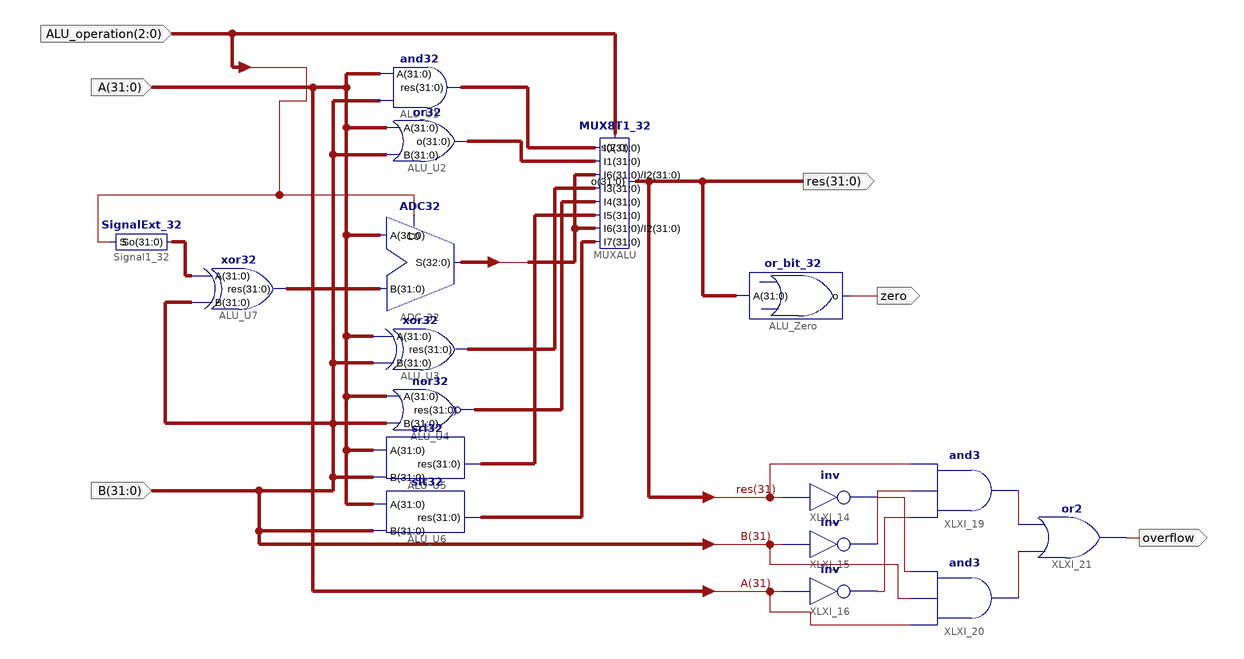
[diagram p0: schematic sheet 1]
// Xilinx ISE schematic ALU.sch (kintex7) as structural Verilog: 17 symbols, 6 ports
module ALU (
  input  [31:0] A,
  input  [31:0] B,
  input  [2:0] ALU_operation,
  output [31:0] res,
  output zero,
  output overflow
);

  wire XLXN_72, XLXN_73, XLXN_74, XLXN_75, XLXN_76;
  wire [31:0] slttttttttt, XLXN_1, XLXN_5, XLXN_14, XLXN_15, XLXN_41, XLXN_45, XLXN_46;
  wire [32:0] S0;

  xor32 ALU_U7 (.A(XLXN_5), .B(B), .res(XLXN_1));
  ADC32 ADC_32 (.B(XLXN_1), .A(A), .C0(ALU_operation[2]), .S(S0));
  xor32 ALU_U3 (.A(A), .B(B), .res(XLXN_41));
  nor32 ALU_U4 (.res(XLXN_15), .A(A), .B(B));
  and32 ALU_U1 (.res(XLXN_45), .A(A), .B(B));
  MUX8T1_32 MUXALU (
    .s(ALU_operation), .I7(slttttttttt), .I6(S0[31:0]), .I5(XLXN_14), .I4(XLXN_15), .I3(XLXN_41),
    .I2(S0[31:0]), .I1(XLXN_46), .I0(XLXN_45), .o(res));
  or_bit_32 ALU_Zero (.o(zero), .A(res));
  SignalExt_32 Signal1_32 (.So(XLXN_5), .S(ALU_operation[2]));
  or32 ALU_U2 (.o(XLXN_46), .A(A), .B(B));
  not XLXI_14 (XLXN_72, res[31]);
  not XLXI_15 (XLXN_73, B[31]);
  not XLXI_16 (XLXN_74, A[31]);
  and XLXI_19 (XLXN_75, XLXN_74, XLXN_73, res[31]);
  and XLXI_20 (XLXN_76, A[31], B[31], XLXN_72);
  or XLXI_21 (overflow, XLXN_76, XLXN_75);
  srl32 ALU_U5 (.A(A), .B(B), .res(XLXN_14));
  slt32 ALU_U6 (.A(A), .B(B), .res(slttttttttt));
endmodule
